# EAGLE schematic interstage_A1 (EAGLE 9.2.2)
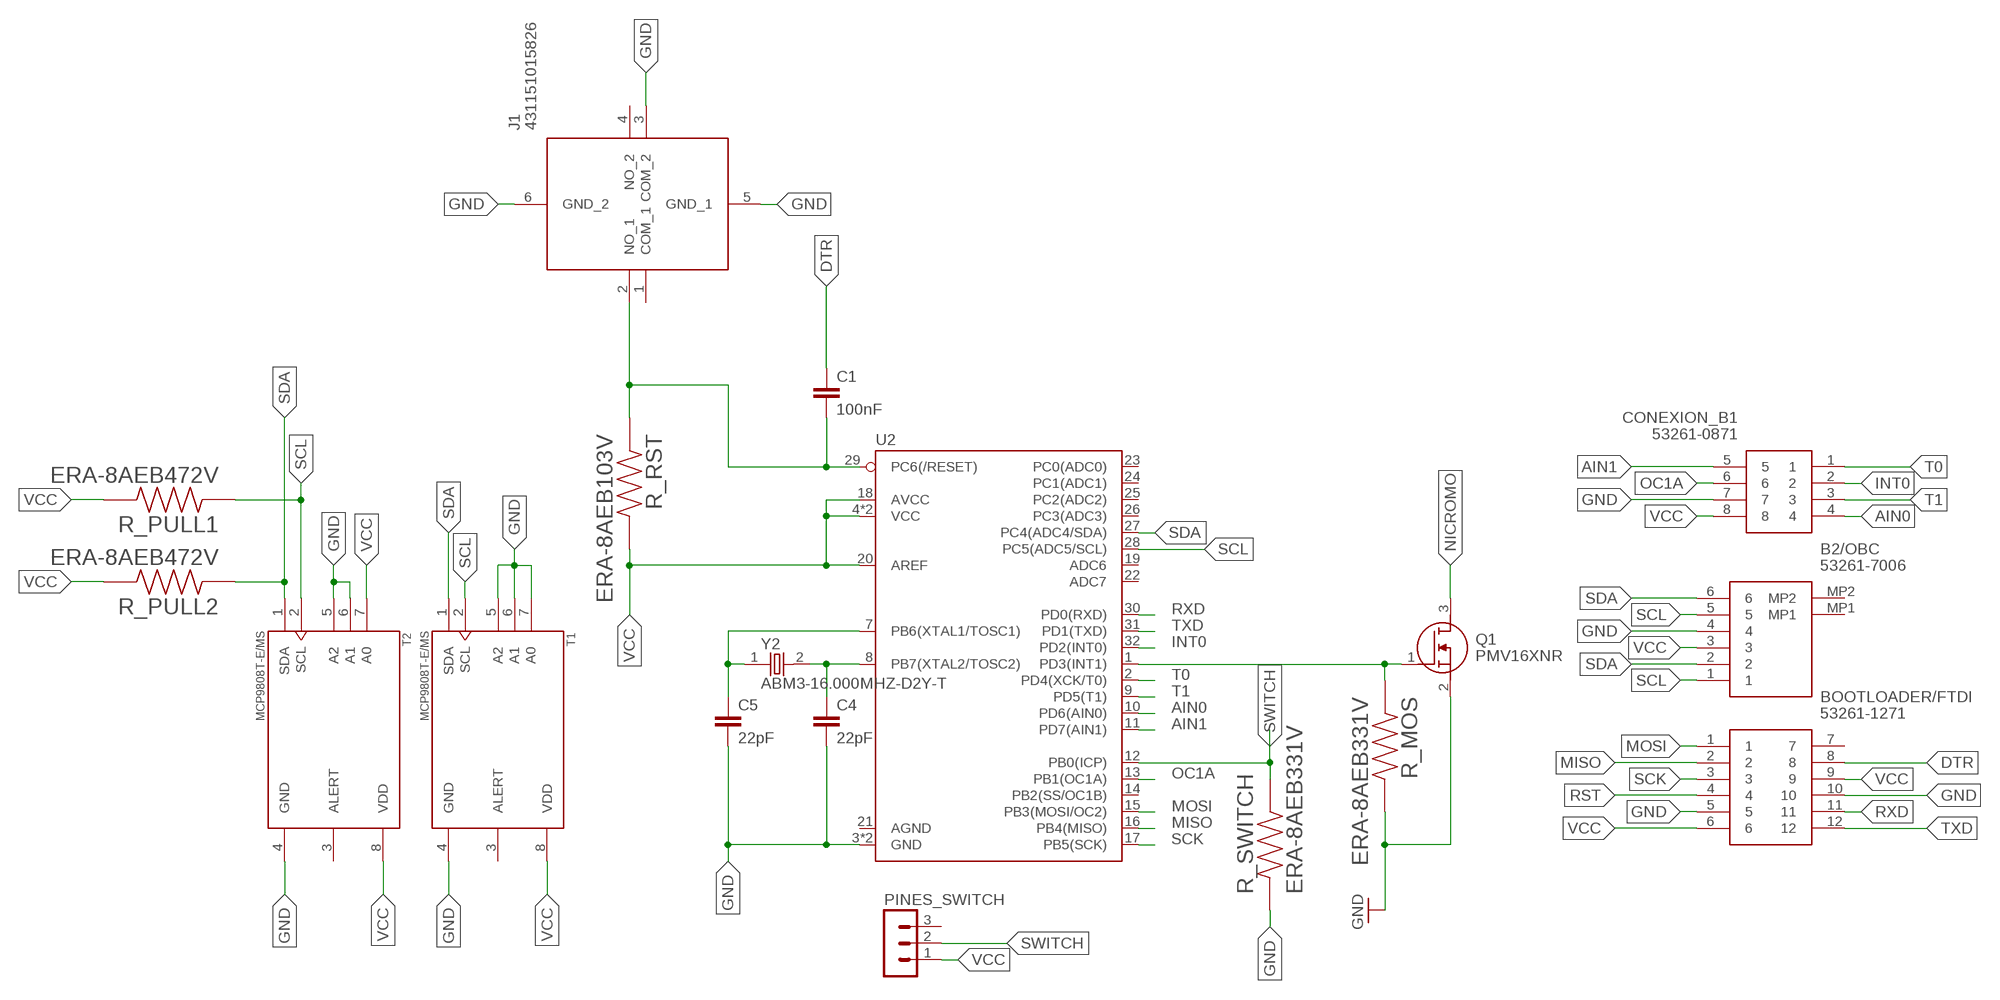
[diagram p0: schematic, sheet 1]

## Parts
B2/OBC  53261-7006  [532617006]
BOOTLOADER/FTDI  53261-1271  [53261-1271]
C1  100nF  C-EUC0805K  [C0805K]
C4  22pF  C-EUC0603K  [C0603K]
C5  22pF  C-EUC0603K  [C0603K]
CONEXION_B1  53261-0871  [53261-0871]
J1  431151015826  [431151015826]
PINES_SWITCH  MA03-1  [MA03-1]
Q1  PMV16XNR  [SOT95P230X110-3N]
R_MOS  ERA-8AEB331V  [RESC3216X70N]
R_PULL1  ERA-8AEB472V  [RESC3216X70N]
R_PULL2  ERA-8AEB472V  [RESC3216X70N]
R_RST  ERA-8AEB103V  [RESC3216X70N]
R_SWITCH  ERA-8AEB331V  [RESC3216X70N]
T1  MCP9808T-E/MS  [SOP65P490X110-8N]
T2  MCP9808T-E/MS  [SOP65P490X110-8N]
U2  ATMEGA328P_TQFP  [TQFP32-08]
Y2  ABM3-16.000MHZ-D2Y-T  [XTAL500X320X130N]

## Nets
AIN0: CONEXION_B1.4 U2.10(PD6(AIN0))
AIN1: CONEXION_B1.5 U2.11(PD7(AIN1))
DTR: BOOTLOADER/FTDI.8 C1.1
GND: B2/OBC.4 BOOTLOADER/FTDI.5 BOOTLOADER/FTDI.10 C4.2 C5.2 CONEXION_B1.7 J1.3(COM_2) J1.5(GND_1) J1.6(GND_2) Q1.2(S) R_MOS.2 R_SWITCH.1 T1.4(GND) T1.5(A2) T1.6(A1) T1.7(A0) T2.4(GND) T2.5(A2) T2.6(A1) U2.3(GND) U2.5(GND)
INT0: CONEXION_B1.2 U2.32(PD2(INT0))
INT1: Q1.1(G) R_MOS.1 U2.1(PD3(INT1))
MISO: BOOTLOADER/FTDI.2 U2.16(PB4(MISO))
MOSI: BOOTLOADER/FTDI.1 U2.15(PB3(MOSI/OC2))
N$1: C5.1 U2.7(PB6(XTAL1/TOSC1)) Y2.1
N$2: C4.1 U2.8(PB7(XTAL2/TOSC2)) Y2.2
NICROMO: Q1.3(D)
OC1A: CONEXION_B1.6 U2.13(PB1(OC1A))
RST: BOOTLOADER/FTDI.4 C1.2 J1.2(NO_1) R_RST.1 U2.29(PC6(/RESET))
RXD: BOOTLOADER/FTDI.11 U2.30(PD0(RXD))
SCK: BOOTLOADER/FTDI.3 U2.17(PB5(SCK))
SCL: B2/OBC.1 B2/OBC.5 R_PULL1.1 T1.2(SCL) T2.2(SCL) U2.28(PC5(ADC5/SCL))
SDA: B2/OBC.2 B2/OBC.6 R_PULL2.1 T1.1(SDA) T2.1(SDA) U2.27(PC4(ADC4/SDA))
SWITCH: PINES_SWITCH.2 R_SWITCH.2 U2.12(PB0(ICP))
T0: CONEXION_B1.1 U2.2(PD4(XCK/T0))
T1: CONEXION_B1.3 U2.9(PD5(T1))
TXD: BOOTLOADER/FTDI.12 U2.31(PD1(TXD))
VCC: B2/OBC.3 BOOTLOADER/FTDI.6 BOOTLOADER/FTDI.9 CONEXION_B1.8 PINES_SWITCH.1 R_PULL1.2 R_PULL2.2 R_RST.2 T1.8(VDD) T2.7(A0) T2.8(VDD) U2.4(VCC) U2.6(VCC) U2.18(AVCC) U2.20(AREF)
Unconnected: B2/OBC.MP1 B2/OBC.MP2 BOOTLOADER/FTDI.7 J1.1(COM_1) J1.4(NO_2) PINES_SWITCH.3 T1.3(ALERT) T2.3(ALERT) U2.14(PB2(SS/OC1B)) U2.19(ADC6) U2.21(AGND) U2.22(ADC7) U2.23(PC0(ADC0)) U2.24(PC1(ADC1)) U2.25(PC2(ADC2)) U2.26(PC3(ADC3))

## Library data of the parts
B2/OBC = SamacSys_Parts:53261-7006: 1.25mm Pitch, PicoBlade PCB Header, Single Row, Right-Angle, Surface Mount, Gold (Au) Plating, Friction Lock, Circuits, Tape and Reel Source: Datasheet <https://componentsearchengine.com/Datasheets/1/53261-7006.pdf>; DESCRIPTION: 1.25mm Pitch, PicoBlade PCB Header, Single Row, Right-Angle, Surface Mount, Gold (Au) Plating, Friction Lock, Circuits, Tape and Reel; HEIGHT: 3.6mm; MANUFACTURER_NAME: Molex; MANUFACTURER_PART_NUMBER: 53261-7006; MOUSER_PART_NUMBER: 538-53261-7006; MOUSER_PRICE-STOCK: https://www.mouser.co.uk/ProductDetail/Molex/53261-7006?qs=0lSvoLzn4L%2FSBef0BTU2GA%3D%3D
BOOTLOADER/FTDI = SamacSys_Parts:53261-1271: Molex PICOBLADE Series, Series Number 53261, 1.25mm Pitch 12 Way 1 Row Right Angle PCB Header, Solder Termination, 1A Source: Datasheet <http://www.molex.com/webdocs/datasheets/pdf/en-us//0532611271_PCB_HEADERS.pdf>; DESCRIPTION: Molex PICOBLADE Series, Series Number 53261, 1.25mm Pitch 12 Way 1 Row Right Angle PCB Header, Solder Termination, 1A; HEIGHT: mm; MANUFACTURER_NAME: Molex; MANUFACTURER_PART_NUMBER: 53261-1271; MOUSER_PART_NUMBER: 538-53261-1271; MOUSER_PRICE-STOCK: https://www.mouser.co.uk/ProductDetail/Molex/53261-1271?qs=%252B72YyncTwW8ciqCjtXK7Ww%3D%3D
C1 C4 C5 = rcl:C-EU: CAPACITOR, European symbol; SPICEPREFIX: C
CONEXION_B1 = SamacSys_Parts:53261-0871: Molex PICOBLADE Series, Series Number 53261, 1.25mm Pitch, 8 Way 1 Row Shrouded Right Angle PCB Header, Surface Mount Source: Datasheet <http://www.molex.com/webdocs/datasheets/pdf/en-us/0532610871_PCB_HEADERS.pdf>; DESCRIPTION: Molex PICOBLADE Series, Series Number 53261, 1.25mm Pitch, 8 Way 1 Row Shrouded Right Angle PCB Header, Surface Mount; HEIGHT: mm; MANUFACTURER_NAME: Molex; MANUFACTURER_PART_NUMBER: 53261-0871; MOUSER_PART_NUMBER: 538-53261-0871; MOUSER_PRICE-STOCK: https://www.mouser.co.uk/ProductDetail/Molex/53261-0871?qs=%252B72YyncTwW%252BggfdCJ7Netw%3D%3D
J1 = SamacSys_Parts:431151015826: White Tactile Tactile Switch, NO 20 mA 0.3mm Surface Mount Source: Datasheet <https://componentsearchengine.com/Datasheets/2/431151015826.pdf>; DESCRIPTION: White Tactile Tactile Switch, NO 20 mA 0.3mm Surface Mount; HEIGHT: 1.6mm; MANUFACTURER_NAME: Wurth Elektronik; MANUFACTURER_PART_NUMBER: 431151015826; MOUSER_PART_NUMBER: 710-431151015826; MOUSER_PRICE-STOCK: https://www.mouser.co.uk/ProductDetail/Wurth-Elektronik/431151015826?qs=wr8lucFkNMWt0fEnpc%252BesA%3D%3D
PINES_SWITCH = con-lstb:MA03-1: PIN HEADER; OC_FARNELL: unknown; OC_NEWARK: unknown
Q1 = SamacSys_Parts:PMV16XNR: Nexperia PMV16XNR N-channel MOSFET, 8.6 A, 20 V PMV16XN, 3-Pin SOT-23 Source: Datasheet <https://componentsearchengine.com/Datasheets/1/PMV16XNR.pdf>; DESCRIPTION: Nexperia PMV16XNR N-channel MOSFET, 8.6 A, 20 V PMV16XN, 3-Pin SOT-23; HEIGHT: 1.1mm; MANUFACTURER_NAME: Nexperia; MANUFACTURER_PART_NUMBER: PMV16XNR; MOUSER_PART_NUMBER: 771-PMV16XNR; MOUSER_PRICE-STOCK: https://www.mouser.com/Search/Refine.aspx?Keyword=771-PMV16XNR
R_MOS R_SWITCH = resistor_330_smd:ERA-8AEB331V; DESCRIPTION: 330 Ohms ±0.1% 0.25W, 1/4W Chip Resistor 1206 (3216 Metric) Automotive AEC-Q200 Thin Film; DIGI-KEY_PART_NUMBER: P330BCCT-ND; MF: Panasonic Electronic; MP: ERA-8AEB331V; PACKAGE: 3216 Panasonic Electronic Components
R_PULL1 R_PULL2 = resistor_4700_smd:ERA-8AEB472V; DESCRIPTION: RES SMD 4.7K OHM 0.1% 1/4W 1206; DIGI-KEY_PART_NUMBER: P4.7KBCCT-ND; DIGIKEY-PURCHASE-URL: https://snapeda.com/shop?store=DigiKey&id=3718815; MF: Panasonic; MP: ERA-8AEB472V; PACKAGE: 3216 Panasonic Electronic Components
R_RST = resistor_10000_smd:ERA-8AEB103V; DESCRIPTION: 10 kOhms ±0.1% 0.25W, 1/4W Chip Resistor 1206 (3216 Metric) Automotive AEC-Q200 Thin Film; DIGI-KEY_PART_NUMBER: P10KBCCT-ND; DIGIKEY-PURCHASE-URL: https://snapeda.com/shop?store=DigiKey&id=3229630; MF: Panasonic Electronic Components; MP: ERA-8AEB103V; PACKAGE: 3216 Panasonic Electronic Components
T1 T2 = sensorSPEL:MCP9808T-E/MS: Board Mount Temperature Sensors Silicon temp sensor with I2C interface; DESCRIPTION: Temperature Sensor Digital, Local -40°C ~ 125°C 10 b 8-MSOP; DIGI-KEY_PART_NUMBER: MCP9808T-E/MSCT-ND; MF: Microchip; MP: MCP9808T-E/MS; PACKAGE: MSOP-8 Microchip
U2 = SparkFun-IC-Microcontroller:ATMEGA328P_TQFP: Popular 328P in QFP Storefront component: ATmega328 - TQFP <https://www.sparkfun.com/products/13448> (COM-13448) Datasheet <http://www.sparkfun.com/datasheets/Components/SMD/ATMega328.pdf> SparkFun Products SparkFun RedBoard - Programmed with Arduino <https://www.sparkfun.com/products/12757> (DEV-12757) Arduino Pro Mini 328 - 5V/16MHz <https://www.sparkfun.com/products/11113> (DEV-11113) Arduino Pro Mini 328 - 3.3V/8MHz <https://www.sparkfun.com/products/11114> (DEV-11114) SparkFun OpenLog <https://www.sparkfun.com/products/13712> (DEV-13712) SparkFun MicroView - OLED Arduino Module <https://www.sparkfun.com/products/12923> (DEV-12923) SparkFun Digital Sandbox <https://www.sparkfun.com/products/12651> (DEV-12651) SparkFun PicoBoard <https://www.sparkfun.com/products/11888> (WIG-11888) Arduino Fio <https://www.sparkfun.com/products/10116> (DEV-10116) LilyPad Arduino 328 Main Board <https://www.sparkfun.com/products/13342> (DEV-13342) SparkFun RedStick <https://www.sparkfun.com/products/13741> (DEV-13741) LilyPad MP3 <https://www.sparkfun.com/products/11013> (DEV-11013) LilyPad Arduino SimpleSnap <https://www.sparkfun.com/products/10941> (DEV-10941) SparkFun Stepoko <https://www.sparkfun.com/products/13899> (ROB-13899) SparkFun Geiger Counter <https://www.sparkfun.com/products/11345> (SEN-11345) SparkFun EL Sequencer <https://www.sparkfun.com/products/12781> (COM-12781) Arduino Pro 328 - 5V/16MHz <https://www.sparkfun.com/products/10915> (DEV-10915) CryptoCape <https://www.sparkfun.com/products/12773> (DEV-12773) SparkFun IR Thermometer Evaluation Board - MLX90614 <https://www.sparkfun.com/products/10740> (SEN-10740) SparkFun RedBot Mainboard <https://www.sparkfun.com/products/12097> (ROB-12097) Arduino Pro 328 - 3.3V/8MHz <https://www.sparkfun.com/products/10914> (DEV-10914) SparkFun Block for Intel® Edison - Arduino <https://www.sparkfun.com/products/13036> (DEV-13036) SparkFun Simon Says - Surface Mount Soldering Kit <https://www.sparkfun.com/products/10935> (KIT-10935) SparkFun 7-Segment Serial Display - Red <https://www.sparkfun.com/products/11441> (COM-11441) SparkFun 7-Segment Serial Display - White <https://www.sparkfun.com/products/11629> (COM-11629) SparkFun 7-Segment Serial Display - Yellow <https://www.sparkfun.com/products/11443> (COM-11443) SparkFun 7-Segment Serial Display - Kelly Green <https://www.sparkfun.com/products/11440> (COM-11440) SparkFun 7-Segment Serial Display - Blue <https://www.sparkfun.com/products/11442> (COM-11442) SparkFun OpenSegment Serial Display - 20mm (Blue) <https://www.sparkfun.com/products/11647> (COM-11647) SparkFun OpenSegment Serial Display - 20mm (Green) <https://www.sparkfun.com/products/11646> (COM-11646) SparkFun OpenSegment Serial Display - 20mm (White) <https://www.sparkfun.com/products/11648> (COM-11648) SparkFun OpenSegment Serial Display - 20mm (Red) <https://www.sparkfun.com/products/11644> (COM-11644) SparkFun OpenSegment Serial Display - 20mm (Yellow) <https://www.sparkfun.com/products/11645> (COM-11645) SparkFun OpenSegment Shield <https://www.sparkfun.com/products/13190> (DEV-13190); PROD_ID: IC-09069
Y2 = ABM3-16.000MHZ-D2Y-T:ABM3-16.000MHZ-D2Y-T: Crystals 12MHz 18pF 30ppm -40C +85C; DESCRIPTION: 16MHz ±20ppm Crystal 18pF 40 Ohms 2-SMD, No Lead; DIGI-KEY_PART_NUMBER: 535-10638-1-ND; DIGIKEY-PURCHASE-URL: https://snapeda.com/shop?store=DigiKey&id=55267; MF: Abracon; MP: ABM3-16.000MHZ-D2Y-T; PACKAGE: SMD-2 Abracon